# Altium schematic sheet GateWay.SchDoc
size A4; SheetNumber: 1; SheetTotal: 1
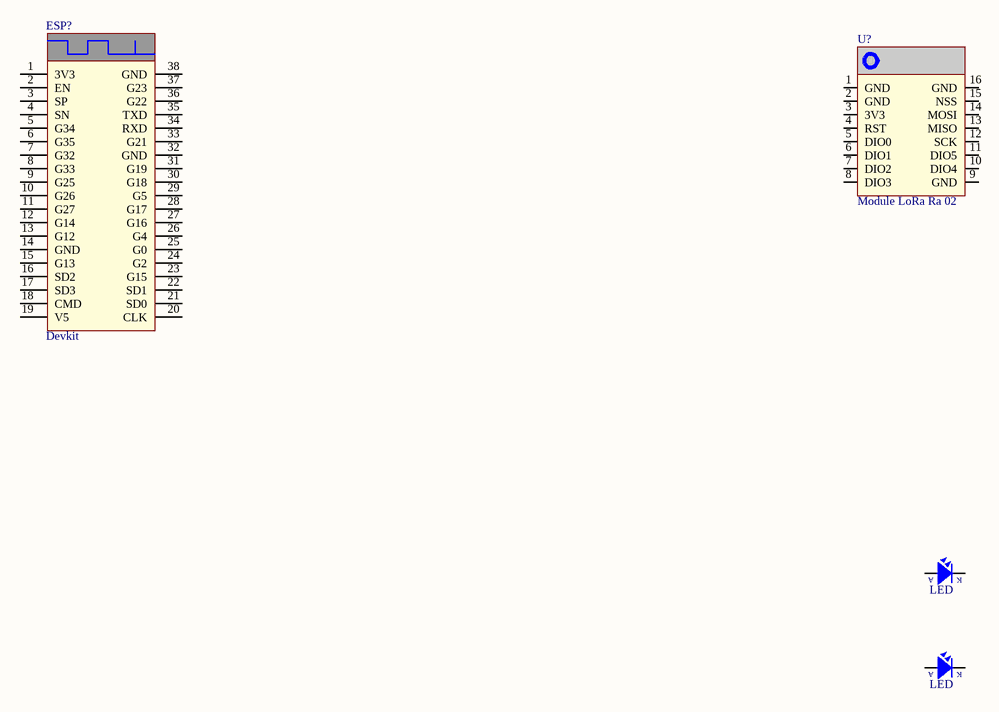
[diagram p0: GateWay.SchDoc]

## Parts
(Parts that share a designator on the sheet are numbered #1, #2 ... from top to bottom, then left to right.)
ESP?  Devkit  [ESP32 DEVKIT 38Pin]
LED?#1  LED  [LED-3]
LED?#2  LED  [LED-3]
U?  Module LoRa Ra 02  [LoRa Ra 02 Module 2]

## Nets

Not connected (* = marked no-connect by the designer): ESP? 1(3V3) 2(EN) 3(SP) 4(SN) 5(G34) 6(G35) 7(G32) 8(G33) 9(G25) 10(G26) 11(G27) 12(G14) 13(G12) 14(GND) 15(G13) 16(SD2) 17(SD3) 18(CMD) 19(V5) 20(CLK) 21(SD0) 22(SD1) 23(G15) 24(G2) 25(G0) 26(G4) 27(G16) 28(G17) 29(G5) 30(G18) 31(G19) 32(GND) 33(G21) 34(RXD) 35(TXD) 36(G22) 37(G23) 38(GND); LED?#1 1(A) 2(K); LED?#2 1(A) 2(K); U? 1(GND) 2(GND) 3(3V3) 4(RST) 5(DIO0) 6(DIO1) 7(DIO2) 8(DIO3) 9(GND) 10(DIO4) 11(DIO5) 12(SCK) 13(MISO) 14(MOSI) 15(NSS) 16(GND)

## Library data of the parts
ESP? = ESP32 DEV KIT: Board
LED?#1 LED?#2 = LED: LED Single colour Green and Red; Value: LED 3 ly Single Colour
U? = LoRa Ra 02 Module 2